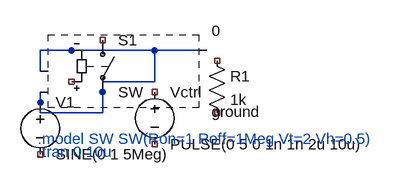
[diagram p0: schematic switchin.asc]
switchin.asc, the LTspice schematic file:
Version 4
SHEET 1 880 680
WIRE 64 96 64 64
WIRE 64 64 160 64
WIRE 160 64 240 64
WIRE 240 64 240 112
WIRE 240 112 160 112
WIRE 160 112 160 160
WIRE 160 160 64 160
WIRE 64 160 64 128
WIRE 240 64 320 64

SYMBOL voltage 64 128 R0
SYMATTR InstName V1
SYMATTR Value SINE(0 1 5Meg)

SYMBOL sw 160 32 R0
SYMATTR InstName S1
SYMATTR Value SW

SYMBOL voltage 240 112 R0
SYMATTR InstName Vctrl
SYMATTR Value PULSE(0 5 0 1n 1n 2u 10u)

SYMBOL res 320 64 R0
SYMATTR InstName R1
SYMATTR Value 1k

SYMBOL ground 64 160 R0
SYMATTR InstName 0

TEXT 60 200 Left 2 .model SW SW(Ron=1 Roff=1Meg Vt=2 Vh=0.5)
TEXT 60 220 Left 2 .tran 0 10u

The netlist it stands for:
* switchin.asc
V1 N001 NC_01 SINE(0 1 5Meg)
S1 NC_02 N001 NC_03 N001 SW
Vctrl NC_04 NC_05 PULSE(0 5 0 1n 1n 2u 10u)
R1 NC_06 NC_07 1k
* 0: ground (symbol ground not available, pin order unknown); nets seen at it: N001
* .model SW SW(Ron=1 Roff=1Meg Vt=2 Vh=0.5)
* .tran 0 10u
.backanno
.end